# Altium schematic sheet STM32F103C8T6_JLINK-OB_V1.0.SchDoc
size A3
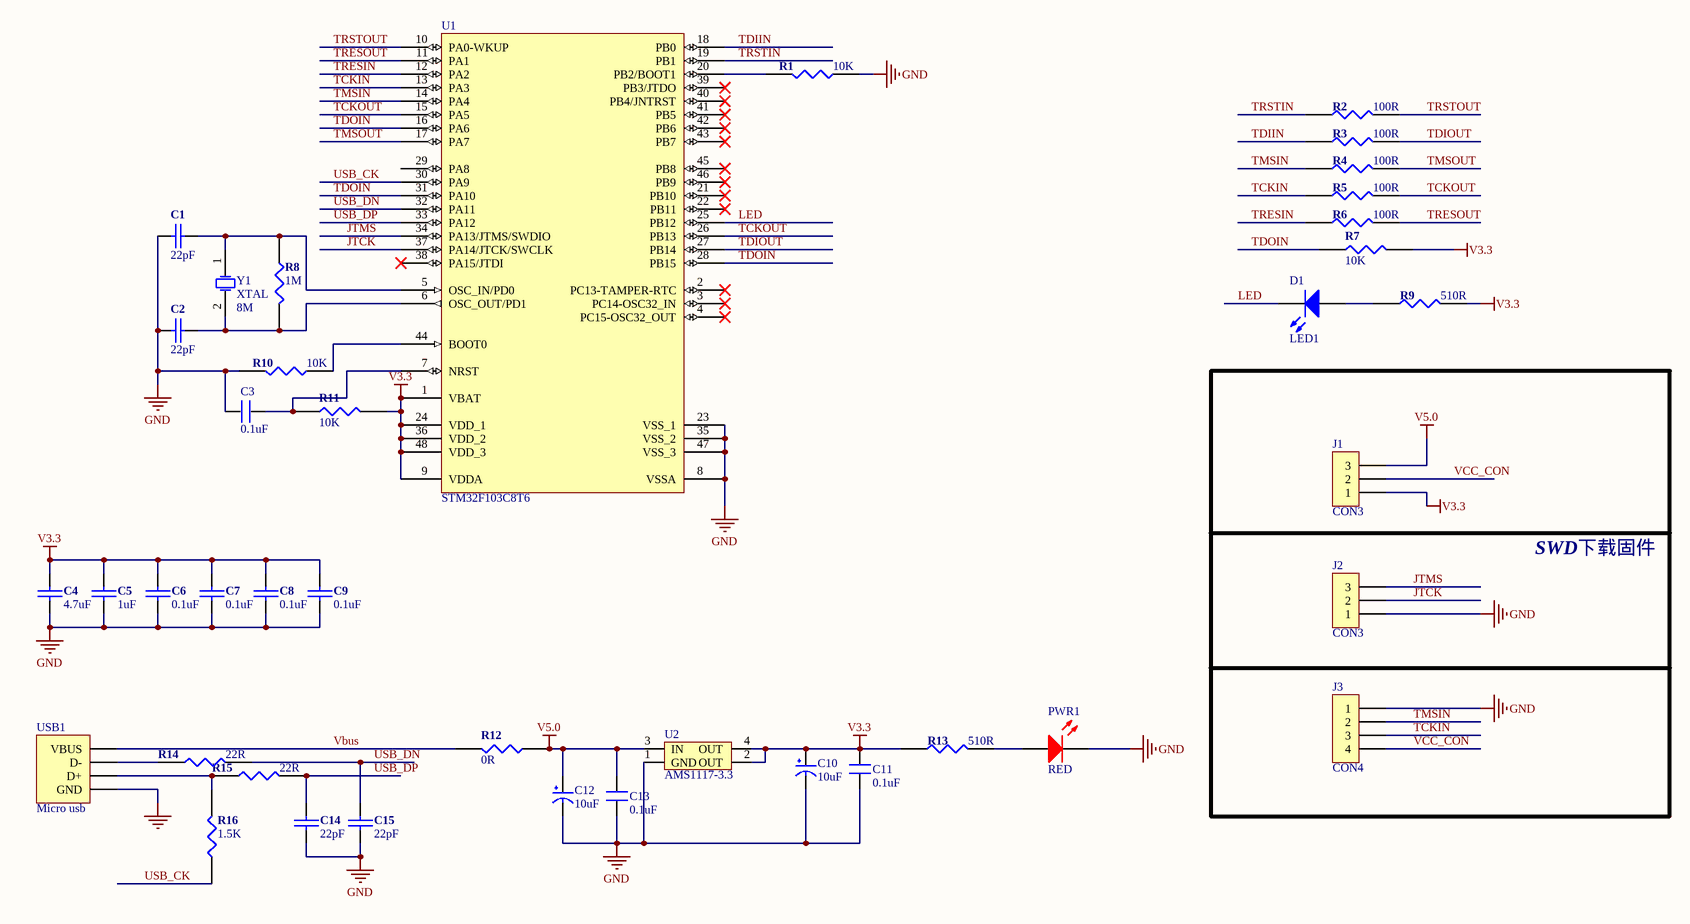
[diagram p0: STM32F103C8T6_JLINK-OB_V1.0.SchDoc]

## Parts
C1  22pF  [C0402]
C2  22pF  [C0402]
C3  0.1uF  [C0402]
C4  4.7uF  [C0603]
C5  1uF  [C0402]
C6  0.1uF  [C0402]
C7  0.1uF  [C0402]
C8  0.1uF  [C0402]
C9  0.1uF  [C0402]
C10  10uF  [C0603]
C11  0.1uF  [C0402]
C12  10uF  [C0603]
C13  0.1uF  [C0402]
C14  22pF  [C0402]
C15  22pF  [C0402]
D1  LED1  [LED0603-green]
J1  CON3  [HEADER-3]
J2  CON3  [HEADER-3]
J3  CON4  [HEADER-4]
PWR1  RED  [LED0603-green]
R1  10K  [R0402 -1]
R2  100R  [R0402 -1]
R3  100R  [R0402 -1]
R4  100R  [R0402 -1]
R5  100R  [R0402 -1]
R6  100R  [R0402 -1]
R7  10K  [R0402 -1]
R8  1M  [R0402 -1]
R9  510R  [R0402 -1]
R10  10K  [R0402 -1]
R11  10K  [R0402 -1]
R12  0R  [R0402 -1]
R13  510R  [R0402 -1]
R14  22R  [R0402 -1]
R15  22R  [R0402 -1]
R16  1.5K  [R0402 -1]
U1  STM32F103C8T6  [LQFP48S]
U2  AMS1117-3.3  [AMS1117]
USB1  Micro usb  [MICRO_USB_9]
Y1  XTAL  [XTAL]

## Blocks framed on the sheet
SWD下载固件: J1-J3

## Nets
4: USB1.5 USB1.6
GND: C1.1 C2.1 C3.1 C4.1 C5.1 C6.1 C7.1 C8.1 C9.1 C10.2(GND) C11.2 C12.2(GND) C13.2 C14.1 C15.1 J2.1 J3.1 PWR1.2(K) R1.1 R10.2 U1.8(VSSA) U1.23(VSS_1) U1.35(VSS_2) U1.47(VSS_3) U2.1(GND) USB1.4(GND)
V3.3: C4.2 C5.2 C6.2 C7.2 C8.2 C9.2 C10.1(VCC) C11.1 J1.1 R7.2 R9.2 R11.2 R13.1 U1.1(VBAT) U1.9(VDDA) U1.24(VDD_1) U1.36(VDD_2) U1.48(VDD_3) U2.2(OUT) U2.4(OUT)
V5.0: C12.1(VCC) C13.1 J1.3 R12.1 U2.3(IN)
JTCK: J2.2 U1.37(PA14/JTCK/SWCLK)
JTMS: J2.3 U1.34(PA13/JTMS/SWDIO)
LED: D1.2(K) U1.25(PB12)
TCKIN: J3.3 R5.1 U1.13(PA3)
TCKOUT: R5.2 U1.15(PA5) U1.26(PB13)
TDIIN: R3.1 U1.18(PB0)
TDIOUT: R3.2 U1.27(PB14)
TDOIN: R7.1 U1.16(PA6) U1.28(PB15) U1.31(PA10)
TMSIN: J3.2 R4.1 U1.14(PA4)
TMSOUT: R4.2 U1.17(PA7)
TRESIN: R6.1 U1.12(PA2)
TRESOUT: R6.2 U1.11(PA1)
TRSTIN: R2.1 U1.19(PB1)
TRSTOUT: R2.2 U1.10(PA0-WKUP)
USB_CK: R16.1 U1.30(PA9)
USB_DN: C15.2 R14.2 U1.32(PA11)
USB_DP: C14.2 R15.2 U1.33(PA12)
Vbus: R12.2 USB1.1(VBUS)
VCC_CON: J1.2 J3.4
NetC1_2: C1.2 R8.1 U1.5(OSC_IN/PD0) Y1.1(OSC1)
NetC2_2: C2.2 R8.2 U1.6(OSC_OUT/PD1) Y1.2(OSC2)
NetC3_2: C3.2 R11.1 U1.7(NRST)
NetD1_1: D1.1(A) R9.1
NetPWR1_1: PWR1.1(A) R13.2
NetR1_2: R1.2 U1.20(PB2/BOOT1)
NetR10_1: R10.1 U1.44(BOOT0)
NetR14_1: R14.1 USB1.2(D-)
NetR15_1: R15.1 R16.2 USB1.3(D+)

Not connected (* = marked no-connect by the designer): U1 2(PC13-TAMPER-RTC)* 3(PC14-OSC32_IN)* 4(PC15-OSC32_OUT)* 21(PB10)* 22(PB11)* 29(PA8) 38(PA15/JTDI)* 39(PB3/JTDO)* 40(PB4/JNTRST)* 41(PB5)* 42(PB6)* 43(PB7)* 45(PB8)* 46(PB9)*

## Notes on the sheet
- (in symbol XTAL) 8M

## Library data of the parts
C1 C2 C4-C9 = CAP: SMT电容; Precision: 6.3V耐压; LIB: SMT电容
C3 C11 C13 = C
C10 C12 = CAP
C14 C15 = 电容: Precision: 6.3V耐压; LIB: SMT电容
D1 = LED0: Typical INFRARED GaAs LED; Published: 8-Jun-2000; LatestRevisionDate: 08-Jul-2005; LatestRevisionNote: Mech Layer 1 removed.; PackageReference: LED-0; Publisher: Altium Limited; PackageDescription: LED; 2 Leads
J1 J2 = CON3: Connector
J3 = CON4: Connector
PWR1 = LED1
R1-R16 = RES1: SMT电阻; Precision: 5% 精度; LIB: SMT 电阻
U1 = STM32F103C8T6: STM32 ARM-based 32-bit MCU with 64 Kbytes Flash, 48-pin LQFP, Industrial Temperature; Published: 30-May-2008; DatasheetVersion: rev6, Mar-2008; PackageVersion: Mar-2008; PackageReference: LQFP48; Publisher: Altium Limited; PackageDescription: 48-Pin Low-Profile Quad Flat Pack, 7 x 7 mm Body, 0.5 mm Pitch (LQFP48); ComponentLink1Description: Manufacturer Link; ComponentLink1URL: www.st.com/stm32; ComponentLink2Description: Datasheet; ComponentLink2URL: http://www.st.com/stonline/products/literature/ds/13587.pdf
U2 = AMS1117
USB1 = USB joggle
Y1 = XTAL: Crystal Oscillator; Published: 8-Jun-2000; LatestRevisionDate: 17-Jul-2002; LatestRevisionNote: Re-released for DXP Platform.; Publisher: Altium Limited